# EAGLE design Pinscape Pico Expansion Board - DIY Friendly Power (EAGLE 7.7.0)

## Sheet 1 of 6: Picos
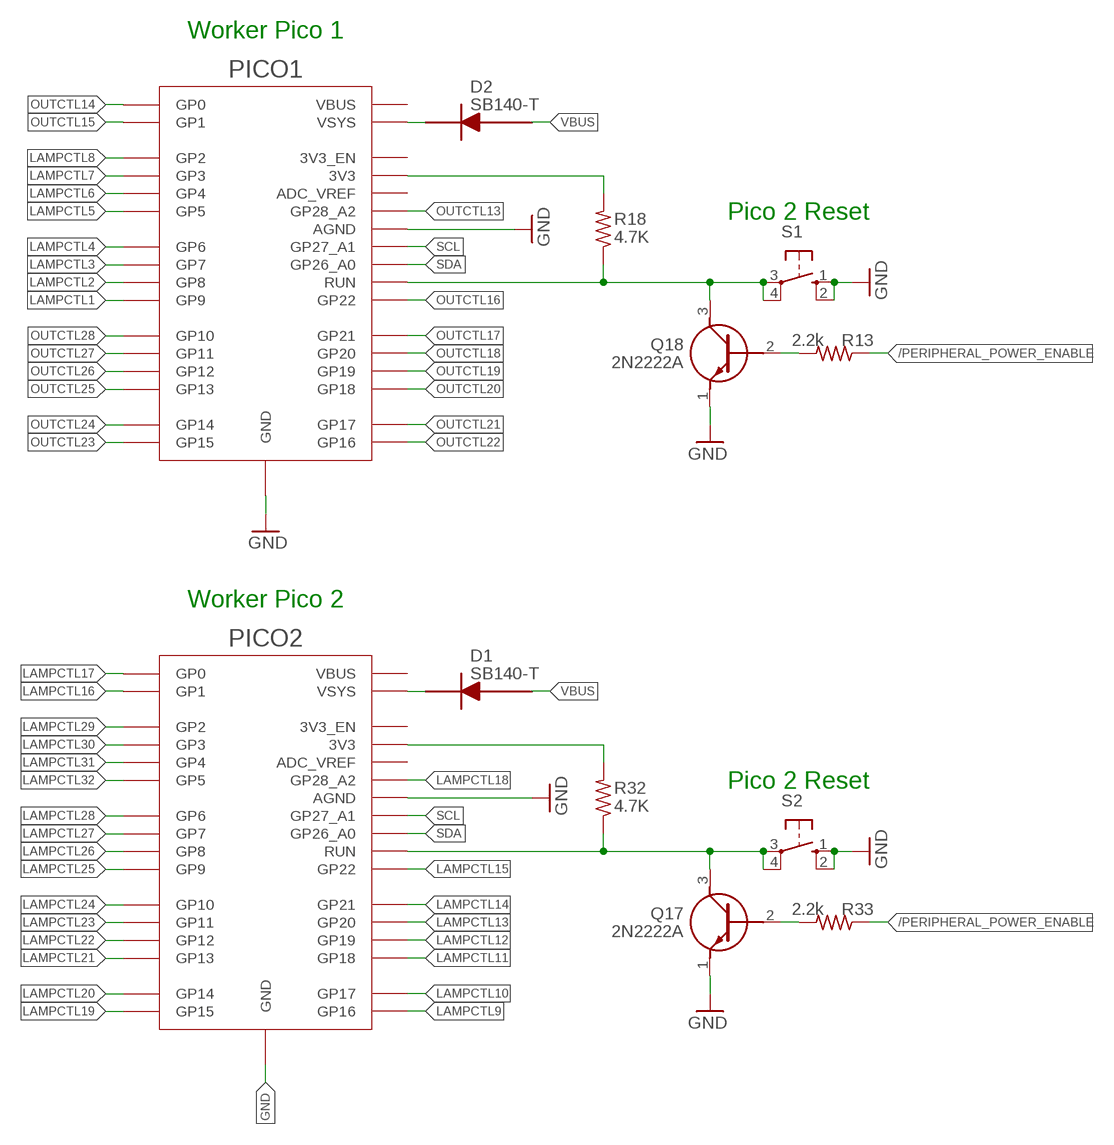
[diagram p0: schematic, sheet 1]

### Parts
D1  SB140-T  [DIOAD1408W86L464D236]
D2  SB140-T  [DIOAD1408W86L464D236]
PICO1  RPI_PICO_NO_DEBUG  [RPI_PICO_TH_NO_DEBUG]
PICO2  RPI_PICO_NO_DEBUG  [RPI_PICO_TH_NO_DEBUG]
Q17  2N2222A  [2N2222A]
Q18  2N2222A  [2N2222A]
R13  2.2k  R-US_0204/7  [0204/7]
R18  4.7K  R-US_0204/7  [0204/7]
R32  4.7K  R-US_0204/7  [0204/7]
R33  2.2k  R-US_0204/7  [0204/7]
S1  10-XX  [B3F-10XX]
S2  10-XX  [B3F-10XX]

### Nets
/PERIPHERAL_POWER_ENABLE: R13.1 R33.1 ; also sheet 2
GND: PICO1.AGND PICO1.GND@1(GND) PICO1.GND@2(GND) PICO1.GND@3(GND) PICO1.GND@4(GND) PICO1.GND@6(GND) PICO1.GND@7(GND) PICO1.GND@8(GND) PICO2.AGND PICO2.GND@1(GND) PICO2.GND@2(GND) PICO2.GND@3(GND) PICO2.GND@4(GND) PICO2.GND@6(GND) PICO2.GND@7(GND) PICO2.GND@8(GND) Q17.1(E) Q18.1(E) S1.1(S) S1.2(S1) S2.1(S) S2.2(S1) ; also sheet 2,3,4,5
LAMPCTL1: PICO1.GP9 ; also sheet 4
LAMPCTL2: PICO1.GP8 ; also sheet 4
LAMPCTL3: PICO1.GP7 ; also sheet 4
LAMPCTL4: PICO1.GP6 ; also sheet 4
LAMPCTL5: PICO1.GP5 ; also sheet 4
LAMPCTL6: PICO1.GP4 ; also sheet 4
LAMPCTL7: PICO1.GP3 ; also sheet 4
LAMPCTL8: PICO1.GP2 ; also sheet 4
LAMPCTL9: PICO2.GP16 ; also sheet 4
LAMPCTL10: PICO2.GP17 ; also sheet 4
LAMPCTL11: PICO2.GP18 ; also sheet 4
LAMPCTL12: PICO2.GP19 ; also sheet 4
LAMPCTL13: PICO2.GP20 ; also sheet 4
LAMPCTL14: PICO2.GP21 ; also sheet 4
LAMPCTL15: PICO2.GP22 ; also sheet 4
LAMPCTL16: PICO2.GP1 ; also sheet 4
LAMPCTL17: PICO2.GP0 ; also sheet 4
LAMPCTL18: PICO2.GP28_A2 ; also sheet 4
LAMPCTL19: PICO2.GP15 ; also sheet 4
LAMPCTL20: PICO2.GP14 ; also sheet 4
LAMPCTL21: PICO2.GP13 ; also sheet 4
LAMPCTL22: PICO2.GP12 ; also sheet 4
LAMPCTL23: PICO2.GP11 ; also sheet 4
LAMPCTL24: PICO2.GP10 ; also sheet 4
LAMPCTL25: PICO2.GP9 ; also sheet 4
LAMPCTL26: PICO2.GP8 ; also sheet 4
LAMPCTL27: PICO2.GP7 ; also sheet 4
LAMPCTL28: PICO2.GP6 ; also sheet 4
LAMPCTL29: PICO2.GP2 ; also sheet 4
LAMPCTL30: PICO2.GP3 ; also sheet 4
LAMPCTL31: PICO2.GP4 ; also sheet 4
LAMPCTL32: PICO2.GP5 ; also sheet 4
N$17: D1.1(K) PICO2.VSYS
N$18: D2.1(K) PICO1.VSYS
N$38: PICO2.3V3 R32.2
N$39: Q17.2(B) R33.2
N$40: PICO2.RUN Q17.3(C) R32.1 S2.3(P) S2.4(P1)
N$41: PICO1.3V3 R18.2
N$42: Q18.2(B) R13.2
N$51: PICO1.RUN Q18.3(C) R18.1 S1.3(P) S1.4(P1)
OUTCTL13: PICO1.GP28_A2 ; also sheet 3
OUTCTL14: PICO1.GP0 ; also sheet 3
OUTCTL15: PICO1.GP1 ; also sheet 3
OUTCTL16: PICO1.GP22 ; also sheet 3
OUTCTL17: PICO1.GP21 ; also sheet 3
OUTCTL18: PICO1.GP20 ; also sheet 3
OUTCTL19: PICO1.GP19 ; also sheet 3
OUTCTL20: PICO1.GP18 ; also sheet 3
OUTCTL21: PICO1.GP17 ; also sheet 3
OUTCTL22: PICO1.GP16 ; also sheet 3
OUTCTL23: PICO1.GP15 ; also sheet 3
OUTCTL24: PICO1.GP14 ; also sheet 3
OUTCTL25: PICO1.GP13 ; also sheet 3
OUTCTL26: PICO1.GP12 ; also sheet 3
OUTCTL27: PICO1.GP11 ; also sheet 3
OUTCTL28: PICO1.GP10 ; also sheet 3
SCL: PICO1.GP27_A1 PICO2.GP27_A1 ; also sheet 2,5
SDA: PICO1.GP26_A0 PICO2.GP26_A0 ; also sheet 2,5
VBUS: D1.2(A) D2.2(A) ; also sheet 2,5
Unconnected: PICO1.3V3_EN PICO1.ADC_VREF PICO1.VBUS PICO2.3V3_EN PICO2.ADC_VREF PICO2.VBUS

### Notes on the sheet
- Worker Pico 1
- Pico 2 Reset
- Worker Pico 2
- Pico 2 Reset

## Sheet 2 of 6: Misc Ports
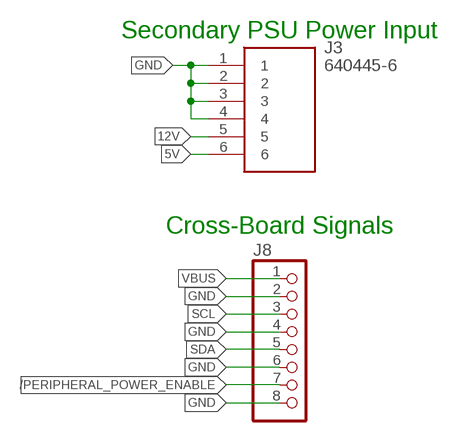
[diagram p1: schematic, sheet 2]

### Parts
J3  640445-6  [SHDR6W183P0X396_1X6_2377X762X1]
J8  PINHD-1X8/90  [1X08/90]

### Nets
5V: J3.6 ; also sheet 4
12V: J3.5 ; also sheet 3
/PERIPHERAL_POWER_ENABLE: J8.7 ; also sheet 1
GND: J3.1 J3.2 J3.3 J3.4 J8.2 J8.4 J8.6 J8.8 ; also sheet 1,3,4,5
SCL: J8.3 ; also sheet 1,5
SDA: J8.5 ; also sheet 1,5
VBUS: J8.1 ; also sheet 1,5

### Notes on the sheet
- Secondary PSU Power Input
- Cross-Board Signals

## Sheet 3 of 6: MOSFET Outputs
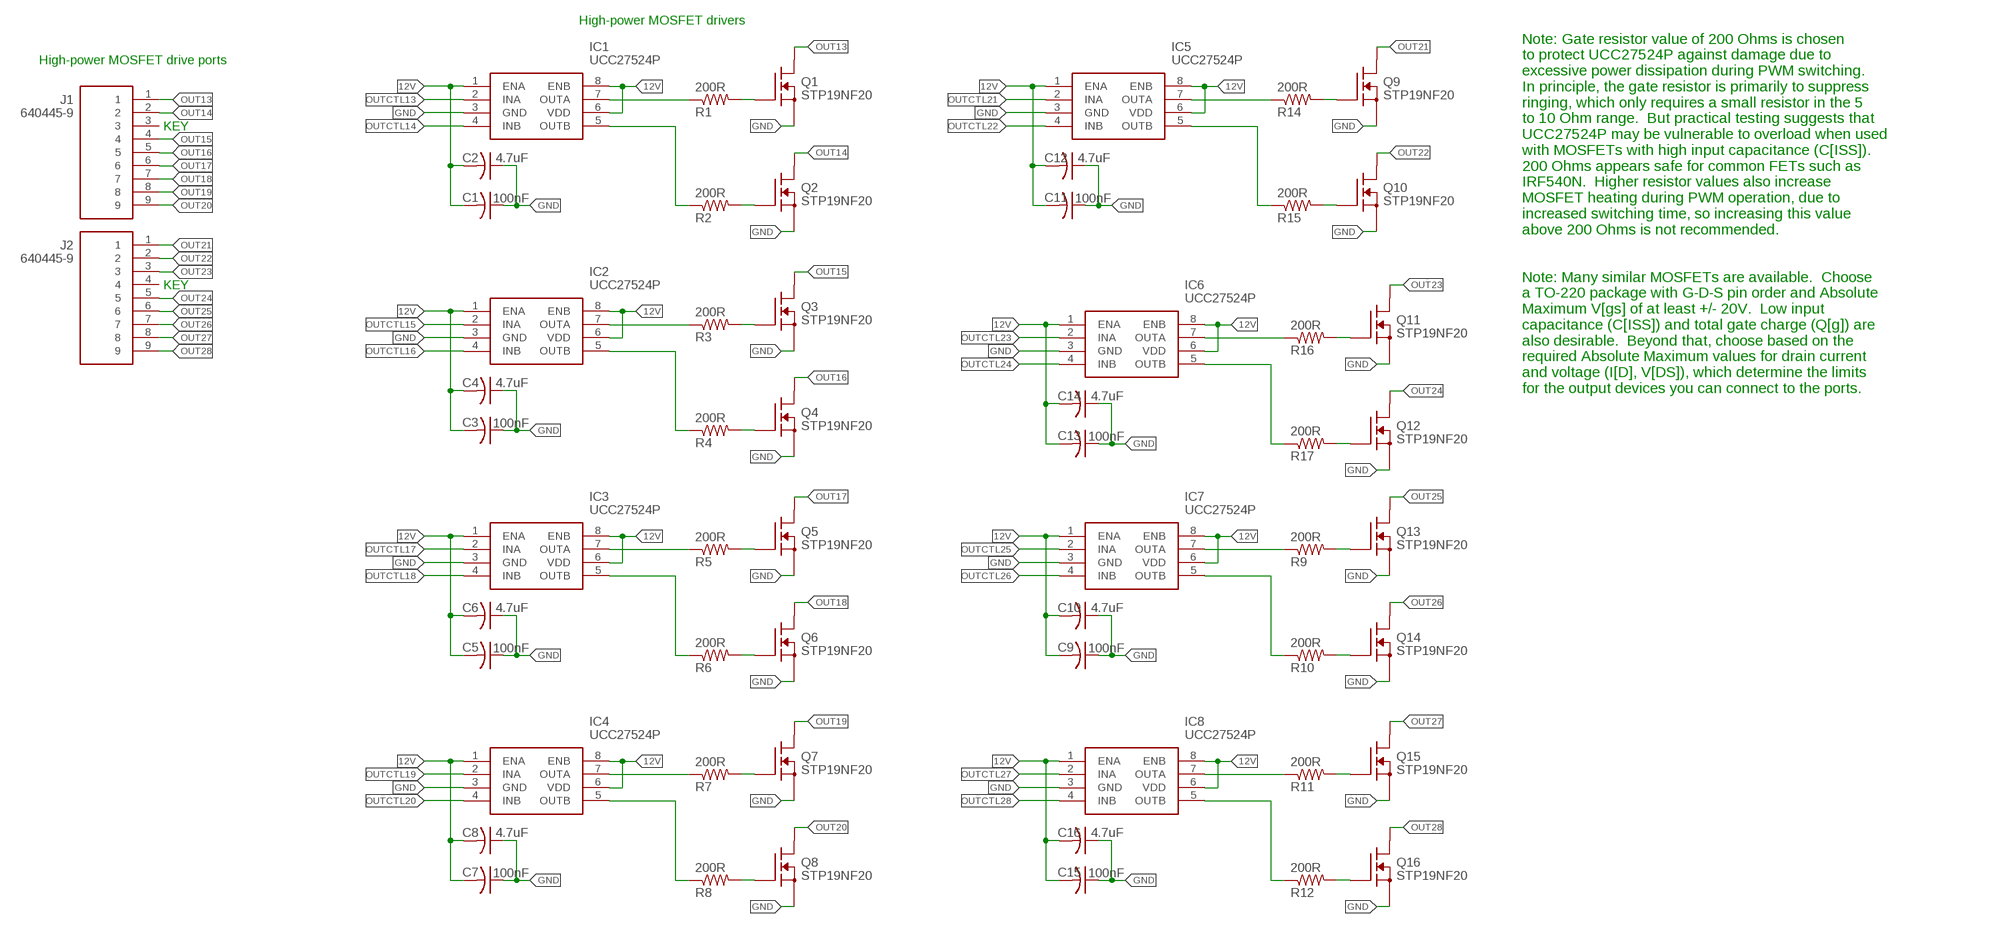
[diagram p2: schematic, sheet 3]

### Parts
C1  100nF  C-US025-024X044  [C025-024X044]
C2  4.7uF  C-US025-024X044  [C025-024X044]
C3  100nF  C-US025-024X044  [C025-024X044]
C4  4.7uF  C-US025-024X044  [C025-024X044]
C5  100nF  C-US025-024X044  [C025-024X044]
C6  4.7uF  C-US025-024X044  [C025-024X044]
C7  100nF  C-US025-024X044  [C025-024X044]
C8  4.7uF  C-US025-024X044  [C025-024X044]
C9  100nF  C-US025-024X044  [C025-024X044]
C10  4.7uF  C-US025-024X044  [C025-024X044]
C11  100nF  C-US025-024X044  [C025-024X044]
C12  4.7uF  C-US025-024X044  [C025-024X044]
C13  100nF  C-US025-024X044  [C025-024X044]
C14  4.7uF  C-US025-024X044  [C025-024X044]
C15  100nF  C-US025-024X044  [C025-024X044]
C16  4.7uF  C-US025-024X044  [C025-024X044]
IC1  UCC27524P  [DIP794W53P254L959H508Q8N]
IC2  UCC27524P  [DIP794W53P254L959H508Q8N]
IC3  UCC27524P  [DIP794W53P254L959H508Q8N]
IC4  UCC27524P  [DIP794W53P254L959H508Q8N]
IC5  UCC27524P  [DIP794W53P254L959H508Q8N]
IC6  UCC27524P  [DIP794W53P254L959H508Q8N]
IC7  UCC27524P  [DIP794W53P254L959H508Q8N]
IC8  UCC27524P  [DIP794W53P254L959H508Q8N]
J1  640445-9  [SHDR9W117P0X396_1X9_3566X762X1]
J2  640445-9  [SHDR9W117P0X396_1X9_3566X762X1]
Q1  STP19NF20  BUK7575-55A  [TO220BV]
Q2  STP19NF20  BUK7575-55A  [TO220BV]
Q3  STP19NF20  BUK7575-55A  [TO220BV]
Q4  STP19NF20  BUK7575-55A  [TO220BV]
Q5  STP19NF20  BUK7575-55A  [TO220BV]
Q6  STP19NF20  BUK7575-55A  [TO220BV]
Q7  STP19NF20  BUK7575-55A  [TO220BV]
Q8  STP19NF20  BUK7575-55A  [TO220BV]
Q9  STP19NF20  BUK7575-55A  [TO220BV]
Q10  STP19NF20  BUK7575-55A  [TO220BV]
Q11  STP19NF20  BUK7575-55A  [TO220BV]
Q12  STP19NF20  BUK7575-55A  [TO220BV]
Q13  STP19NF20  BUK7575-55A  [TO220BV]
Q14  STP19NF20  BUK7575-55A  [TO220BV]
Q15  STP19NF20  BUK7575-55A  [TO220BV]
Q16  STP19NF20  BUK7575-55A  [TO220BV]
R1  200R  R-US_0204/5  [0204/5]
R2  200R  R-US_0204/5  [0204/5]
R3  200R  R-US_0204/5  [0204/5]
R4  200R  R-US_0204/5  [0204/5]
R5  200R  R-US_0204/5  [0204/5]
R6  200R  R-US_0204/5  [0204/5]
R7  200R  R-US_0204/5  [0204/5]
R8  200R  R-US_0204/5  [0204/5]
R9  200R  R-US_0204/5  [0204/5]
R10  200R  R-US_0204/5  [0204/5]
R11  200R  R-US_0204/5  [0204/5]
R12  200R  R-US_0204/5  [0204/5]
R14  200R  R-US_0204/5  [0204/5]
R15  200R  R-US_0204/5  [0204/5]
R16  200R  R-US_0204/5  [0204/5]
R17  200R  R-US_0204/5  [0204/5]

### Nets
12V: C1.2 C2.2 C3.2 C4.2 C5.2 C6.2 C7.2 C8.2 C9.2 C10.2 C11.2 C12.2 C13.2 C14.2 C15.2 C16.2 IC1.1(ENA) IC1.6(VDD) IC1.8(ENB) IC2.1(ENA) IC2.6(VDD) IC2.8(ENB) IC3.1(ENA) IC3.6(VDD) IC3.8(ENB) IC4.1(ENA) IC4.6(VDD) IC4.8(ENB) IC5.1(ENA) IC5.6(VDD) IC5.8(ENB) IC6.1(ENA) IC6.6(VDD) IC6.8(ENB) IC7.1(ENA) IC7.6(VDD) IC7.8(ENB) IC8.1(ENA) IC8.6(VDD) IC8.8(ENB) ; also sheet 2
GND: C1.1 C2.1 C3.1 C4.1 C5.1 C6.1 C7.1 C8.1 C9.1 C10.1 C11.1 C12.1 C13.1 C14.1 C15.1 C16.1 IC1.3(GND) IC2.3(GND) IC3.3(GND) IC4.3(GND) IC5.3(GND) IC6.3(GND) IC7.3(GND) IC8.3(GND) Q1.3(S) Q2.3(S) Q3.3(S) Q4.3(S) Q5.3(S) Q6.3(S) Q7.3(S) Q8.3(S) Q9.3(S) Q10.3(S) Q11.3(S) Q12.3(S) Q13.3(S) Q14.3(S) Q15.3(S) Q16.3(S) ; also sheet 1,2,4,5
N$1: IC1.7(OUTA) R1.1
N$2: IC1.5(OUTB) R2.1
N$3: Q1.1(G) R1.2
N$4: Q2.1(G) R2.2
N$5: IC2.7(OUTA) R3.1
N$6: IC2.5(OUTB) R4.1
N$7: Q3.1(G) R3.2
N$8: Q4.1(G) R4.2
N$9: IC3.7(OUTA) R5.1
N$10: IC3.5(OUTB) R6.1
N$11: Q5.1(G) R5.2
N$12: Q6.1(G) R6.2
N$13: IC4.7(OUTA) R7.1
N$14: IC4.5(OUTB) R8.1
N$15: Q7.1(G) R7.2
N$16: Q8.1(G) R8.2
N$19: IC5.7(OUTA) R14.1
N$20: IC5.5(OUTB) R15.1
N$21: IC7.7(OUTA) R9.1
N$22: IC7.5(OUTB) R10.1
N$23: Q13.1(G) R9.2
N$24: Q14.1(G) R10.2
N$25: Q9.1(G) R14.2
N$26: Q10.1(G) R15.2
N$27: IC6.7(OUTA) R16.1
N$28: IC6.5(OUTB) R17.1
N$29: Q11.1(G) R16.2
N$30: Q12.1(G) R17.2
N$31: IC8.7(OUTA) R11.1
N$32: IC8.5(OUTB) R12.1
N$33: Q15.1(G) R11.2
N$34: Q16.1(G) R12.2
OUT13: J1.1 Q1.2(D)
OUT14: J1.2 Q2.2(D)
OUT15: J1.4 Q3.2(D)
OUT16: J1.5 Q4.2(D)
OUT17: J1.6 Q5.2(D)
OUT18: J1.7 Q6.2(D)
OUT19: J1.8 Q7.2(D)
OUT20: J1.9 Q8.2(D)
OUT21: J2.1 Q9.2(D)
OUT22: J2.2 Q10.2(D)
OUT23: J2.3 Q11.2(D)
OUT24: J2.5 Q12.2(D)
OUT25: J2.6 Q13.2(D)
OUT26: J2.7 Q14.2(D)
OUT27: J2.8 Q15.2(D)
OUT28: J2.9 Q16.2(D)
OUTCTL13: IC1.2(INA) ; also sheet 1
OUTCTL14: IC1.4(INB) ; also sheet 1
OUTCTL15: IC2.2(INA) ; also sheet 1
OUTCTL16: IC2.4(INB) ; also sheet 1
OUTCTL17: IC3.2(INA) ; also sheet 1
OUTCTL18: IC3.4(INB) ; also sheet 1
OUTCTL19: IC4.2(INA) ; also sheet 1
OUTCTL20: IC4.4(INB) ; also sheet 1
OUTCTL21: IC5.2(INA) ; also sheet 1
OUTCTL22: IC5.4(INB) ; also sheet 1
OUTCTL23: IC6.2(INA) ; also sheet 1
OUTCTL24: IC6.4(INB) ; also sheet 1
OUTCTL25: IC7.2(INA) ; also sheet 1
OUTCTL26: IC7.4(INB) ; also sheet 1
OUTCTL27: IC8.2(INA) ; also sheet 1
OUTCTL28: IC8.4(INB) ; also sheet 1
Unconnected: J1.3 J2.4

### Notes on the sheet
- High-power MOSFET drivers
- Note: Gate resistor value of 200 Ohms is chosen
  to protect UCC27524P against damage due to
  excessive power dissipation during PWM switching.
  In principle, the gate resistor is primarily to suppress
  ringing, which only requires a small resistor in the 5
  to 10 Ohm range.  But practical testing suggests that
  UCC27524P may be vulnerable to overload when used
  with MOSFETs with high input capacitance (C[ISS]).
  200 Ohms appears safe for common FETs such as
  IRF540N.  Higher resistor values also increase
  MOSFET heating during PWM operation, due to
  increased switching time, so increasing this value
  above 200 Ohms is not recommended.
- High-power MOSFET drive ports
- KEY
- Note: Many similar MOSFETs are available.  Choose
  a TO-220 package with G-D-S pin order and Absolute
  Maximum V[gs] of at least +/- 20V.  Low input
  capacitance (C[ISS]) and total gate charge (Q[g]) are
  also desirable.  Beyond that, choose based on the
  required Absolute Maximum values for drain current
  and voltage (I[D], V[DS]), which determine the limits
  for the output devices you can connect to the ports.
- KEY

## Sheet 4 of 6: Lamp Outputs
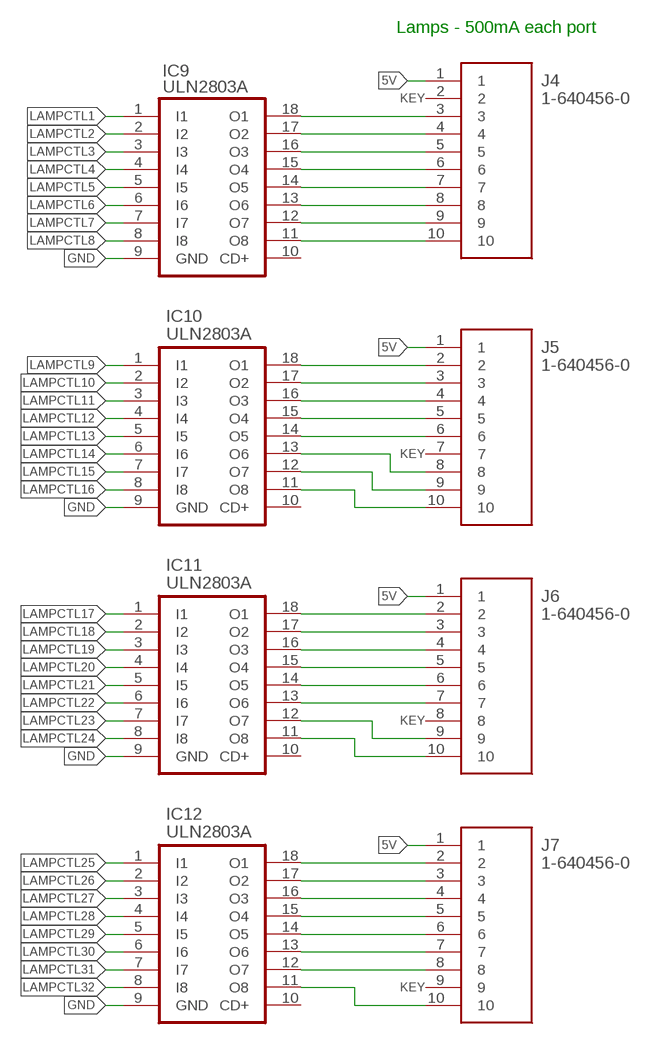
[diagram p3: schematic, sheet 4]

### Parts
IC9  ULN2803A  [DIL18]
IC10  ULN2803A  [DIL18]
IC11  ULN2803A  [DIL18]
IC12  ULN2803A  [DIL18]
J4  1-640456-0  [SHDR10W66P0X254_1X10_2540X572X]
J5  1-640456-0  [SHDR10W66P0X254_1X10_2540X572X]
J6  1-640456-0  [SHDR10W66P0X254_1X10_2540X572X]
J7  1-640456-0  [SHDR10W66P0X254_1X10_2540X572X]

### Nets
5V: J4.1 J5.1 J6.1 J7.1 ; also sheet 2
GND: IC9.9(GND) IC10.9(GND) IC11.9(GND) IC12.9(GND) ; also sheet 1,2,3,5
LAMPCTL1: IC9.1(I1) ; also sheet 1
LAMPCTL2: IC9.2(I2) ; also sheet 1
LAMPCTL3: IC9.3(I3) ; also sheet 1
LAMPCTL4: IC9.4(I4) ; also sheet 1
LAMPCTL5: IC9.5(I5) ; also sheet 1
LAMPCTL6: IC9.6(I6) ; also sheet 1
LAMPCTL7: IC9.7(I7) ; also sheet 1
LAMPCTL8: IC9.8(I8) ; also sheet 1
LAMPCTL9: IC10.1(I1) ; also sheet 1
LAMPCTL10: IC10.2(I2) ; also sheet 1
LAMPCTL11: IC10.3(I3) ; also sheet 1
LAMPCTL12: IC10.4(I4) ; also sheet 1
LAMPCTL13: IC10.5(I5) ; also sheet 1
LAMPCTL14: IC10.6(I6) ; also sheet 1
LAMPCTL15: IC10.7(I7) ; also sheet 1
LAMPCTL16: IC10.8(I8) ; also sheet 1
LAMPCTL17: IC11.1(I1) ; also sheet 1
LAMPCTL18: IC11.2(I2) ; also sheet 1
LAMPCTL19: IC11.3(I3) ; also sheet 1
LAMPCTL20: IC11.4(I4) ; also sheet 1
LAMPCTL21: IC11.5(I5) ; also sheet 1
LAMPCTL22: IC11.6(I6) ; also sheet 1
LAMPCTL23: IC11.7(I7) ; also sheet 1
LAMPCTL24: IC11.8(I8) ; also sheet 1
LAMPCTL25: IC12.1(I1) ; also sheet 1
LAMPCTL26: IC12.2(I2) ; also sheet 1
LAMPCTL27: IC12.3(I3) ; also sheet 1
LAMPCTL28: IC12.4(I4) ; also sheet 1
LAMPCTL29: IC12.5(I5) ; also sheet 1
LAMPCTL30: IC12.6(I6) ; also sheet 1
LAMPCTL31: IC12.7(I7) ; also sheet 1
LAMPCTL32: IC12.8(I8) ; also sheet 1
N$43: IC12.18(O1) J7.2
N$44: IC12.17(O2) J7.3
N$45: IC12.16(O3) J7.4
N$46: IC12.15(O4) J7.5
N$47: IC12.14(O5) J7.6
N$48: IC12.13(O6) J7.7
N$49: IC12.12(O7) J7.8
N$50: IC12.11(O8) J7.10
N$59: IC11.18(O1) J6.2
N$60: IC11.17(O2) J6.3
N$61: IC11.16(O3) J6.4
N$62: IC11.15(O4) J6.5
N$63: IC11.14(O5) J6.6
N$64: IC11.13(O6) J6.7
N$65: IC11.12(O7) J6.9
N$66: IC11.11(O8) J6.10
N$67: IC9.18(O1) J4.3
N$68: IC9.17(O2) J4.4
N$69: IC9.16(O3) J4.5
N$70: IC9.15(O4) J4.6
N$71: IC9.14(O5) J4.7
N$72: IC9.13(O6) J4.8
N$73: IC9.12(O7) J4.9
N$74: IC9.11(O8) J4.10
N$75: IC10.18(O1) J5.2
N$76: IC10.17(O2) J5.3
N$77: IC10.16(O3) J5.4
N$78: IC10.15(O4) J5.5
N$79: IC10.14(O5) J5.6
N$80: IC10.13(O6) J5.8
N$81: IC10.12(O7) J5.9
N$82: IC10.11(O8) J5.10
Unconnected: IC9.10(CD+) IC10.10(CD+) IC11.10(CD+) IC12.10(CD+) J4.2 J5.7 J6.8 J7.9

### Notes on the sheet
- Lamps - 500mA each port
- KEY
- KEY
- KEY
- KEY

## Sheet 5 of 6: Real-Time Clock
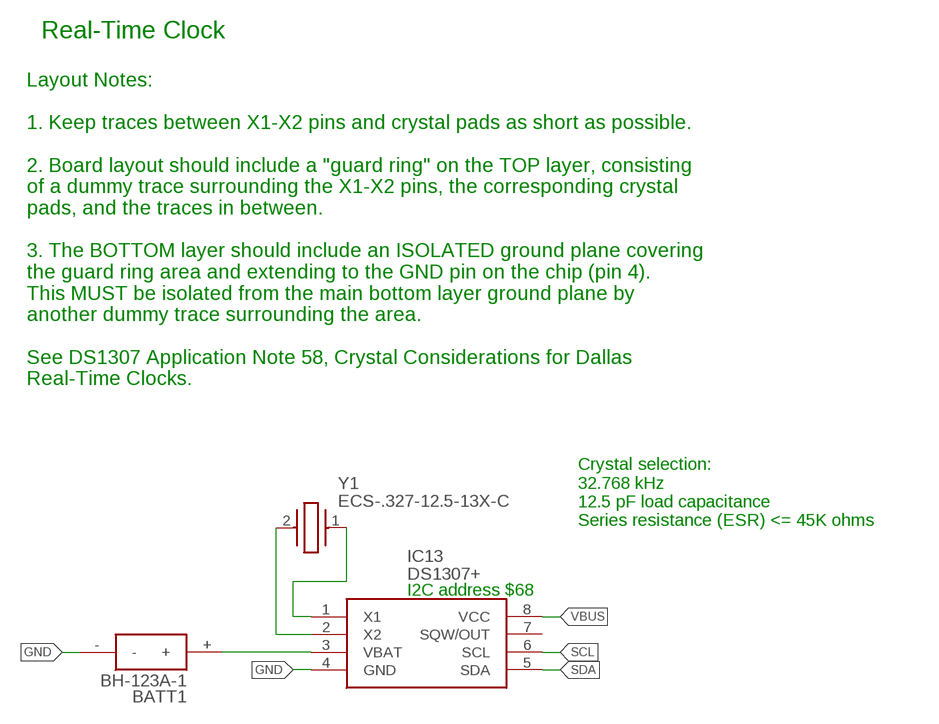
[diagram p4: schematic, sheet 5]

### Parts
BATT1  BH-123A-1  [BH-123A-1]
IC13  DS1307+  [DIP794W56P254L938H457Q8N]
Y1  ECS-.327-12.5-13X-C  [ECS32712513XC]

### Nets
GND: BATT1.- IC13.4(GND) ; also sheet 1,2,3,4
N$35: BATT1.+ IC13.3(VBAT)
N$36: IC13.1(X1) Y1.1(CRYSTAL_1)
N$37: IC13.2(X2) Y1.2(CRYSTAL_2)
SCL: IC13.6(SCL) ; also sheet 1,2
SDA: IC13.5(SDA) ; also sheet 1,2
VBUS: IC13.8(VCC) ; also sheet 1,2
Unconnected: IC13.7(SQW/OUT)

### Notes on the sheet
- Real-Time Clock
- Layout Notes:
  
  1. Keep traces between X1-X2 pins and crystal pads as short as possible.
  
  2. Board layout should include a "guard ring" on the TOP layer, consisting
  of a dummy trace surrounding the X1-X2 pins, the corresponding crystal
  pads, and the traces in between.
  
  3. The BOTTOM layer should include an ISOLATED ground plane covering
  the guard ring area and extending to the GND pin on the chip (pin 4).
  This MUST be isolated from the main bottom layer ground plane by
  another dummy trace surrounding the area.
  
  See DS1307 Application Note 58, Crystal Considerations for Dallas
  Real-Time Clocks.
- Crystal selection:
  32.768 kHz
  12.5 pF load capacitance
  Series resistance (ESR) <= 45K ohms
- I2C address $68

## Sheet 6 of 6: Notes
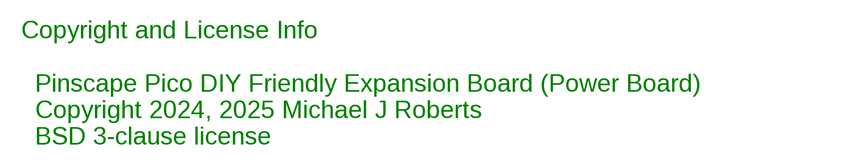
[diagram p5: schematic, sheet 6]

### Notes on the sheet
- Copyright and License Info
  
    Pinscape Pico DIY Friendly Expansion Board (Power Board)
    Copyright 2024, 2025 Michael J Roberts
    BSD 3-clause license

## Library data of the parts
BATT1 = SamacSys_Parts:BH-123A-1: Coin Cell Battery Holders Bat Hld CR2032/2025 Through-hole Mount Source: Datasheet <https://componentsearchengine.com/Datasheets/1/BAT-HLD-001-THM.pdf>
C1 C3 C5 C7 C9 C11 C13 C15 = rcl:C-US: CAPACITOR, American symbol; PARTNO: 21RZ310-RC
C2 C4 C6 C8 C10 C12 C14 C16 = rcl:C-US: CAPACITOR, American symbol; PARTNO: 810-FG14X5R1H475KRT0
D1 D2 = SamacSys_Parts:SB140-T: Schottky Diodes & Rectifiers 1.0A 40V Source: Datasheet <https://www.arrow.com/en/products/sb140-t/diodes-incorporated>; DESCRIPTION: Schottky Diodes & Rectifiers 1.0A 40V; HEIGHT: mm; MANUFACTURER_NAME: Diodes Incorporated; MANUFACTURER_PART_NUMBER: SB140-T; MOUSER_PART_NUMBER: 621-SB140-T; MOUSER_PRICE-STOCK: https://www.mouser.co.uk/ProductDetail/Diodes-Incorporated/SB140-T?qs=sxN%252BoM2fis8H2rSIUCd%252Bfg%3D%3D
IC1-IC8 = SamacSys_Parts:UCC27524P: Dual, 5A, High-Speed Low-Side Power MOSFET Driver Source: Datasheet <http://www.ti.com/lit/gpn/ucc27524>; DESCRIPTION: Dual, 5A, High-Speed Low-Side Power MOSFET Driver; HEIGHT: 5.08mm; MANUFACTURER_NAME: Texas Instruments; MANUFACTURER_PART_NUMBER: UCC27524P; MOUSER_PART_NUMBER: 595-UCC27524P; MOUSER_PRICE-STOCK: https://www.mouser.co.uk/ProductDetail/Texas-Instruments/UCC27524P?qs=iuXUNOC6nYeLYu3RiGlNsQ%3D%3D
IC9-IC12 = uln-udn:ULN2803A: DRIVER ARRAY
IC13 = SamacSys_Parts:DS1307+: Real time clock,DS1307 56B RAM DIP8 Maxim DS1307+ Real Time Clock, Alarm, Calendar, Clock, 56B RAM, I2C, 5.5 V, 8-Pin PDIP Source: Datasheet <http://datasheets.maximintegrated.com/en/ds/DS1307.pdf>; DESCRIPTION: Real time clock,DS1307 56B RAM DIP8 Maxim DS1307+ Real Time Clock, Alarm, Calendar, Clock, 56B RAM, I2C, 5.5 V, 8-Pin PDIP; HEIGHT: 4.572mm; MANUFACTURER_NAME: Analog Devices; MANUFACTURER_PART_NUMBER: DS1307+; MOUSER_PART_NUMBER: 700-DS1307; MOUSER_PRICE-STOCK: https://www.mouser.co.uk/ProductDetail/Analog-Devices-Maxim-Integrated/DS1307%2b?qs=0Y9aZN%252BMVCVfCMpmynAtEg%3D%3D
J1 J2 = SamacSys_Parts:640445-9: Header,MTA156,straight,3.96mm,9way Source: Datasheet <https://www.te.com/commerce/DocumentDelivery/DDEController?Action=srchrtrv&DocNm=82056_MTA&DocType=Data Sheet&DocLang=English&PartCntxt=640445-9&DocFormat=pdf>; DESCRIPTION: Header,MTA156,straight,3.96mm,9way; HEIGHT: 13.716mm; MANUFACTURER_NAME: TE Connectivity; MANUFACTURER_PART_NUMBER: 640445-9; MOUSER_PART_NUMBER: 571-6404459; MOUSER_PRICE-STOCK: https://www.mouser.co.uk/ProductDetail/TE-Connectivity/640445-9?qs=P8zzrVhehauUywCYO3wBKg%3D%3D
J3 = SamacSys_Parts:640445-6: 6 way friction lock header,3.96mm pitch Source: Datasheet <https://componentsearchengine.com/Datasheets/1/640445-6.pdf>; DESCRIPTION: 6 way friction lock header,3.96mm pitch; HEIGHT: 11.049mm; MANUFACTURER_NAME: TE Connectivity; MANUFACTURER_PART_NUMBER: 640445-6; MOUSER_PART_NUMBER: 571-6404456; MOUSER_PRICE-STOCK: https://www.mouser.com/Search/Refine.aspx?Keyword=571-6404456
J4-J7 = SamacSys_Parts:1-640456-0: 10 way MTA straight friction lock header Source: Datasheet <https://datasheet.datasheetarchive.com/originals/distributors/Datasheets_SAMA/53b6d75d7446c4158b7609f45acef8cd.pdf>; DESCRIPTION: 10 way MTA straight friction lock header; HEIGHT: 10.414mm; MANUFACTURER_NAME: TE Connectivity; MANUFACTURER_PART_NUMBER: 1-640456-0; MOUSER_PART_NUMBER: 571-16404560; MOUSER_PRICE-STOCK: https://www.mouser.co.uk/ProductDetail/TE-Connectivity-AMP/1-640456-0?qs=%2F35zJ5USjomFMMbv03PGrg%3D%3D
J8 = pinhead:PINHD-1X8: PIN HEADER
PICO1 PICO2 = RaspberryPi_Pico:RPI_PICO_NO_DEBUG
Q1-Q16 = BUK7575:BUK7575-55A; PARTNO: FDPF085N10A
Q17 Q18 = SamacSys_Parts:2N2222A: NPN General purpose transistor . IC 150 mA . f 100 MHz Source: Datasheet <https://diotec.com/request/datasheet/2n2222a.pdf>; DESCRIPTION: NPN General purpose transistor . IC 150 mA . f 100 MHz; HEIGHT: 7.5mm; MANUFACTURER_NAME: Diotec; MANUFACTURER_PART_NUMBER: 2N2222A; MOUSER_PART_NUMBER: 637-2N2222A; MOUSER_PRICE-STOCK: https://www.mouser.co.uk/ProductDetail/Diotec-Semiconductor/2N2222A?qs=OlC7AqGiEDmNlRSTGL2dYg%3D%3D
R1-R18 R32 R33 = resistor:R-US_: RESISTOR, American symbol; PARTNO: 660-MFS1/4DCT52R47R0
S1 S2 = switch-omron:10-XX: OMRON SWITCH; MPN: B3F-1000; OC_FARNELL: 176432; OC_NEWARK: 36M3542
Y1 = SamacSys_Parts:ECS-.327-12.5-13X-C: Crystals CRYSTAL 32.768 kHZ 12.5 PF SMD, ESR 35K Ohms, +/-10ppm -20 C 70 C, 2.1 x 6.2 1 uw Max +/- 3 ppm 1st Year Aging Max Source: Datasheet; DESCRIPTION: Crystals CRYSTAL 32.768 kHZ 12.5 PF SMD, ESR 35K Ohms, +/-10ppm -20 C 70 C, 2.1 x 6.2 1 uw Max +/- 3 ppm 1st Year Aging Max; HEIGHT: 6.2mm; MANUFACTURER_NAME: ECS; MANUFACTURER_PART_NUMBER: ECS-.327-12.5-13X-C; MOUSER_PART_NUMBER: 520-S-.32712.513XC; MOUSER_PRICE-STOCK: https://www.mouser.co.uk/ProductDetail/ECS/ECS-.327-12.5-13X-C?qs=zW32dvEIR3sSXlfaut3cdQ%3D%3D

## Board
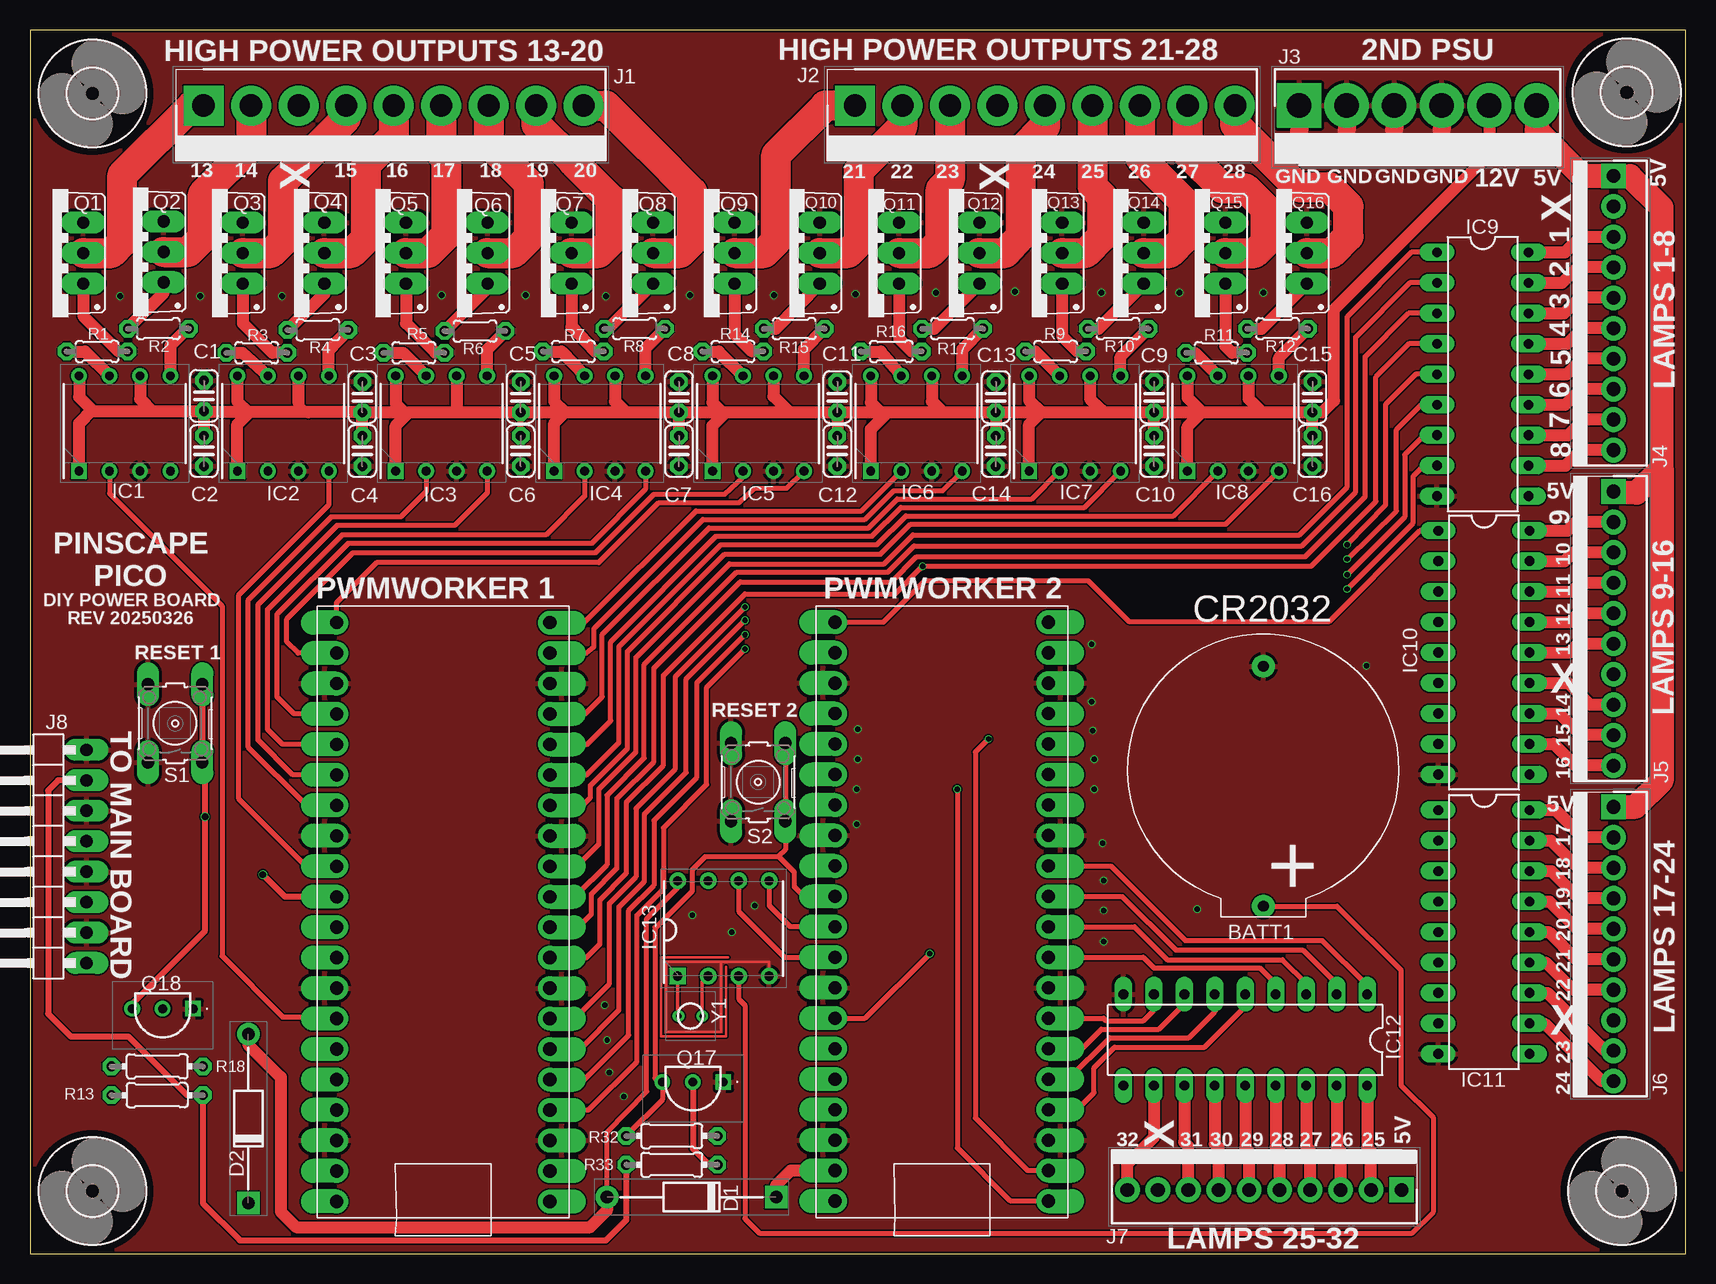
[diagram p6: board, top side]
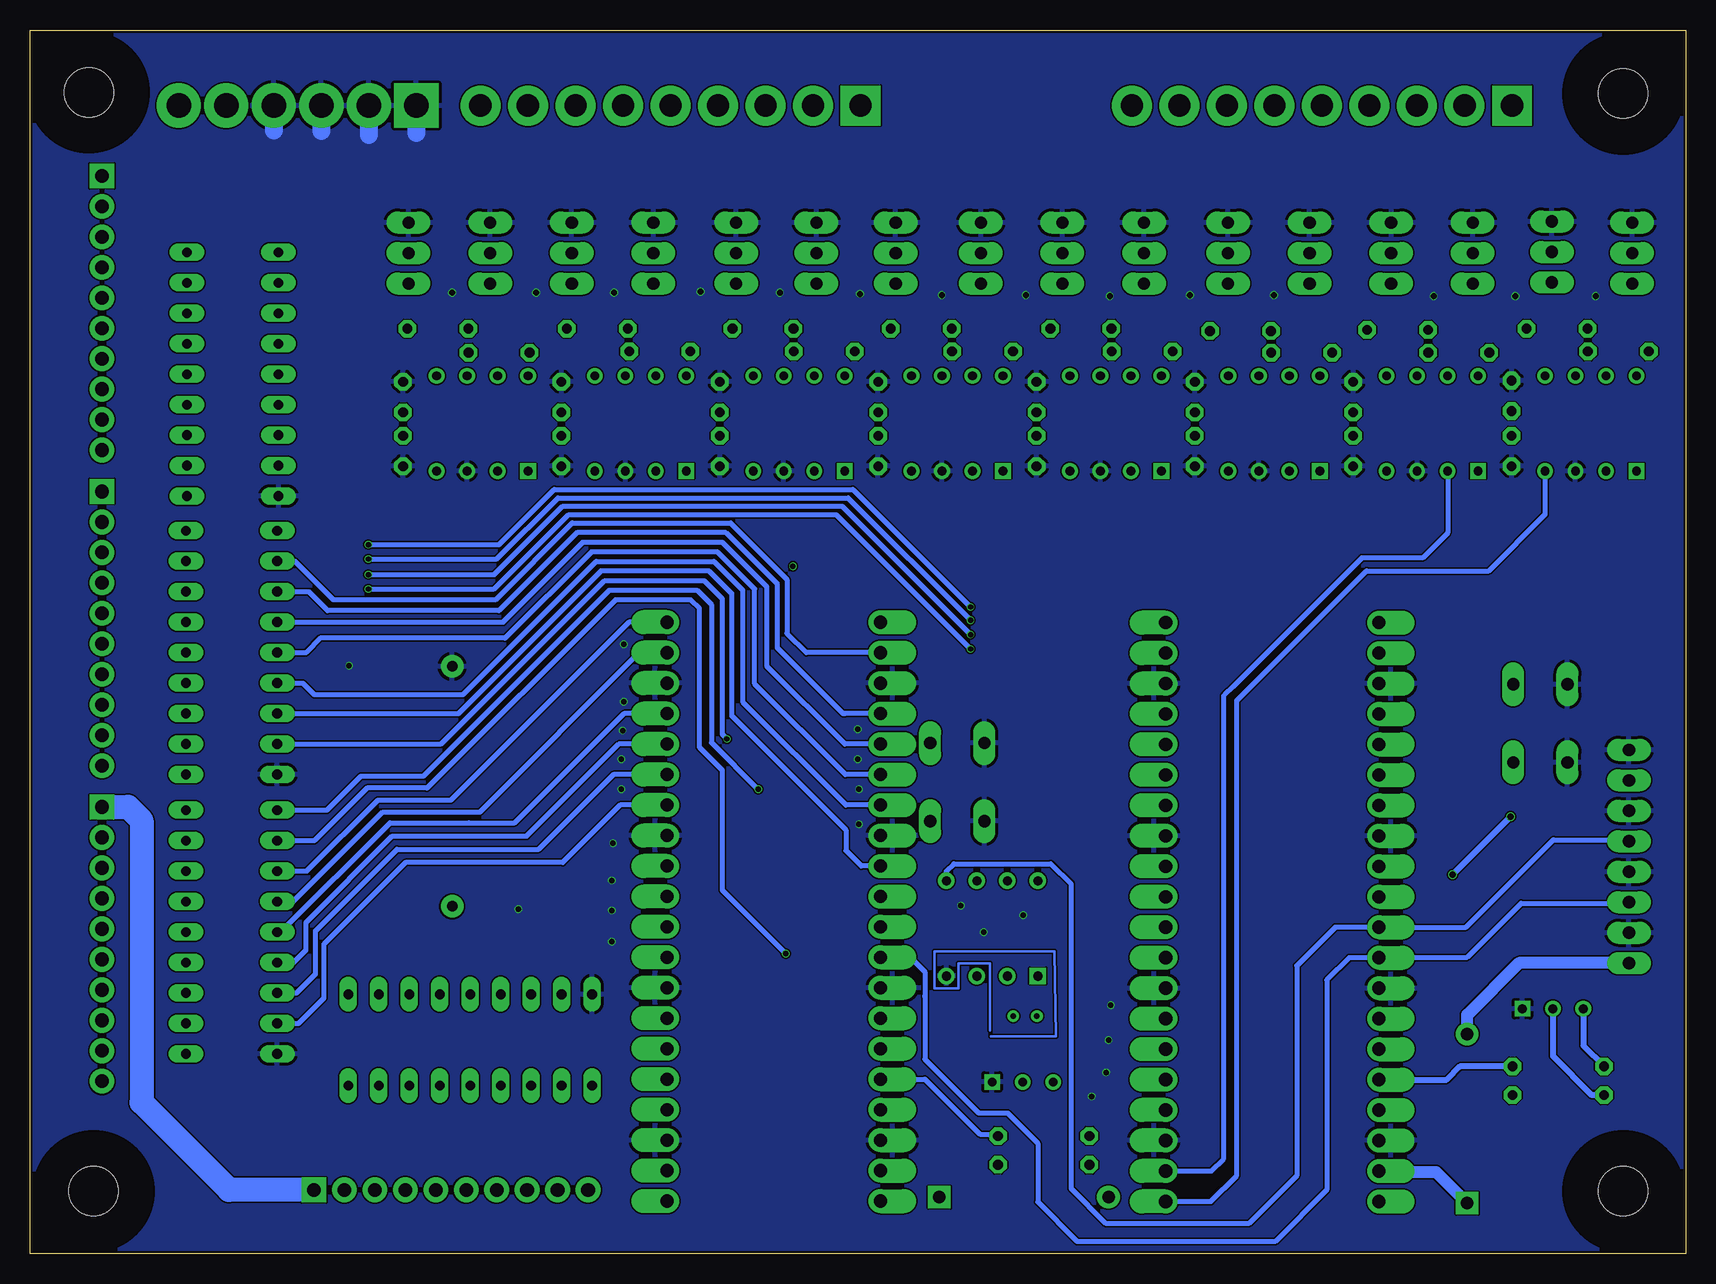
[diagram p7: board, bottom side, seen from below]

Size 138 x 102 mm. Coordinates in mm from the lower left corner, seen from the top.
Outline: 0,0 138,0 138,102 0,102 0,0
Copper layers (1*16): Top 0.035mm / dielectric 1.6mm / Bottom 0.035mm
Design rules "jlcpcb-2layers": minimum track width 5mil, minimum drill 0.3mm, track to track 5mil, track to pad 5mil, pad to pad 5mil, via to via 5mil, smd to smd 5mil, copper to edge 0.2mm, drill to drill 6mil, minimum pad ring 10mil, minimum via ring 3mil, stop-mask expansion 4mil, vias tented up to drill 0mil, thermal gap 10mil

### Footprints (pad centres in the part's own frame; a part is rotated, then mirrored left to right if it is on the bottom)
BH-123A-1 = drill 0.9 pad 1.9: + 11.45,0; - -8.55,0
C025-024X044 = drill 0.813 octagon: 1 -1.27,0; 2 1.27,0
DIOAD1408W86L464D236 = drill 1.05 pad 1.575 square: 1 0,0 | drill 1.05 pad 1.575: 2 14.1,0
DIP794W53P254L959H508Q8N = drill 0.73 pad 1.13 square: 1 -3.97,3.81 | drill 0.73 pad 1.13: 2 -3.97,1.27; 3 -3.97,-1.27; 4 -3.97,-3.81; 5 3.97,-3.81; 6 3.97,-1.27; 7 3.97,1.27; 8 3.97,3.81
DIL18 = drill 0.813 long: 1 -10.16,-3.81; 2 -7.62,-3.81; 3 -5.08,-3.81; 4 -2.54,-3.81; 5 0,-3.81; 6 2.54,-3.81; 7 5.08,-3.81; 8 7.62,-3.81; 9 10.16,-3.81; 10 10.16,3.81; 11 7.62,3.81; 12 5.08,3.81; 13 2.54,3.81; 14 0,3.81; 15 -2.54,3.81; 16 -5.08,3.81; 17 -7.62,3.81; 18 -10.16,3.81
DIP794W56P254L938H457Q8N = drill 0.76 pad 1.16 square: 1 -3.97,3.81 | drill 0.76 pad 1.16: 2 -3.97,1.27; 3 -3.97,-1.27; 4 -3.97,-3.81; 5 3.97,-3.81; 6 3.97,-1.27; 7 3.97,1.27; 8 3.97,3.81
SHDR9W117P0X396_1X9_3566X762X1 = drill 1.85 pad 2.775 square: 1 15.84,0 | drill 1.85 pad 2.775: 2 11.878,0; 3 7.916,0; 4 3.954,0; 5 -0.008,0; 6 -3.97,0; 7 -7.932,0; 8 -11.894,0; 9 -15.856,0
SHDR6W183P0X396_1X6_2377X762X1 = drill 2.05 pad 3.075 square: 1 0,0 | drill 2.05 pad 3.075: 2 3.96,0; 3 7.92,0; 4 11.88,0; 5 15.84,0; 6 19.8,0
SHDR10W66P0X254_1X10_2540X572X = drill 1.15 pad 1.725 square: 1 11.43,0 | drill 1.15 pad 1.725: 2 8.89,0; 3 6.35,0; 4 3.81,0; 5 1.27,0; 6 -1.27,0; 7 -3.81,0; 8 -6.35,0; 9 -8.89,0; 10 -11.43,0
1X08/90 = drill 1.016 long: 1 -8.89,-3.81; 2 -6.35,-3.81; 3 -3.81,-3.81; 4 -1.27,-3.81; 5 1.27,-3.81; 6 3.81,-3.81; 7 6.35,-3.81; 8 8.89,-3.81
RPI_PICO_TH_NO_DEBUG = drill 1.1 pad 1.6 offset: 3V3 8.89,13.97; 3V3_EN 8.89,16.51; ADC_VREF 8.89,11.43; AGND 8.89,6.35; GND@1 -8.89,19.05; GND@2 -8.89,6.35; GND@3 -8.89,-6.35; GND@4 -8.89,-19.05; GND@6 8.89,-19.05; GND@7 8.89,-6.35; GND@8 8.89,19.05; GP0 -8.89,24.13; GP1 -8.89,21.59; GP2 -8.89,16.51; GP3 -8.89,13.97; GP4 -8.89,11.43; GP5 -8.89,8.89; GP6 -8.89,3.81; GP7 -8.89,1.27; GP8 -8.89,-1.27; GP9 -8.89,-3.81; GP10 -8.89,-8.89; GP11 -8.89,-11.43; GP12 -8.89,-13.97; GP13 -8.89,-16.51; GP14 -8.89,-21.59; GP15 -8.89,-24.13; GP16 8.89,-24.13; GP17 8.89,-21.59; GP18 8.89,-16.51; GP19 8.89,-13.97; GP20 8.89,-11.43; GP21 8.89,-8.89; GP22 8.89,-3.81; GP26_A0 8.89,1.27; GP27_A1 8.89,3.81; GP28_A2 8.89,8.89; RUN 8.89,-1.27; VBUS 8.89,24.13; VSYS 8.89,21.59
TO220BV = drill 1.016 long: 1 -2.54,-2.54; 2 0,-2.54; 3 2.54,-2.54
2N2222A = drill 0.72 pad 1.234 square: 1 0,0 | drill 0.72 pad 1.234: 2 2.54,0; 3 5.08,0
0204/5 = drill 0.813 pad 1.333 octagon: 1 -2.54,0; 2 2.54,0
0204/7 = drill 0.813 octagon: 1 -3.81,0; 2 3.81,0
B3F-10XX = drill 1.016 long: 1 -3.251,2.261; 2 3.251,2.261; 3 -3.251,-2.261; 4 3.251,-2.261
4,1 = hole 4.1: 0,0
ECS32712513XC = drill 0.46 pad 0.6: 1 -0.635,0; 2 1.335,0

### Placement (x,y rotation side)
BATT1  102.8,40.4 270 top
C1  14.5,71.5 270 top
C2  14.5,66.9 90 top
C3  27.7,71.4 270 top
C4  27.7,66.9 90 top
C5  40.9,71.4 270 top
C6  40.9,66.9 90 top
C7  54.1,66.9 90 top
C8  54.1,71.4 270 top
C9  93.7,71.4 270 top
C10  93.7,66.9 90 top
C11  67.3,71.4 270 top
C12  67.3,66.9 90 top
C13  80.5,71.4 270 top
C14  80.5,66.9 90 top
C15  106.9,71.4 270 top
C16  106.9,66.9 90 top
D1  62.2,4.7 180 top
D2  18.2,4.2 90 top
IC1  7.9,69.2 90 top
IC2  21.1,69.2 90 top
IC3  34.3,69.2 90 top
IC4  47.5,69.2 90 top
IC5  60.7,69.2 90 top
IC6  73.9,69.2 90 top
IC7  87.1,69.2 90 top
IC8  100.3,69.2 90 top
IC9  121.1,73.3 270 top
IC10  121.2,50.1 270 top
IC11  121.2,26.8 270 top
IC12  101.3,17.8 180 top
IC13  57.8,27.1 90 top
J1  30.3,95.7 180 top
J2  84.6,95.7 180 top
J3  105.8,95.7 0 top
J4  132,78.4 90 top
J5  132,52.1 90 top
J6  132,25.8 90 top
J7  102.9,5.3 0 top
J8  0.9,33.1 90 top
PICO1  34.45,28.47 180 top
PICO2  76,28.5 180 top
Q1  1.9,83.4 90 top
Q2  8.6,83.5 90 top
Q3  15.2,83.4 90 top
Q4  22,83.4 90 top
Q5  28.8,83.4 90 top
Q6  35.6,83.4 90 top
Q7  42.6,83.4 90 top
Q8  49.4,83.4 90 top
Q9  56.2,83.4 90 top
Q10  63.3,83.4 90 top
Q11  69.9,83.4 90 top
Q12  76.6,83.4 90 top
Q13  83.5,83.4 90 top
Q14  90.3,83.4 90 top
Q15  97.1,83.4 90 top
Q16  103.9,83.4 90 top
Q17  57.8,14.3 180 top
Q18  13.6,20.4 180 top
R1  5.6,75.2 0 top
R2  10.7,77.1 180 top
R3  18.9,75.1 0 top
R4  24,77 180 top
R5  32,75.1 0 top
R6  37.1,76.9 180 top
R7  45.3,75.2 0 top
R8  50.4,77.1 180 top
R9  85.5,75.2 0 top
R10  90.7,77.1 180 top
R11  98.9,75.1 0 top
R12  104,77.1 180 top
R13  10.6,13.2 180 top
R14  58.6,75.2 0 top
R15  63.7,77.1 180 top
R16  71.8,75.2 0 top
R17  76.9,77.1 180 top
R18  10.6,15.6 0 top
R32  53.5,9.8 0 top
R33  53.5,7.4 0 top
S1  12.1,44.2 90 top
S2  60.7,39.3 90 top
U$1  [4,1]  5.2,96.7 0 top
U$2  [4,1]  133.1,96.8 0 top
U$3  [4,1]  132.7,5.2 0 top
U$4  [4,1]  5.2,5.2 0 top
Y1  54.7,19.8 0 top

### Tracks (layer width: path | path; a pad name or v marks a point on that pad's centre or on a via)
5V
  Top 2: J5.1 133.93,63.43 136,65.5 | 136,65.5 136,87.2 133.37,89.83 J4.1 129.4,89.83 125.6,93.63 J3.6 | 136,65.5 136,39.4 133.83,37.23 J6.1
  Bottom 2: J6.1 129.83,37.23 128.7,36.1 128.7,12.6 121.4,5.3 J7.1
12V
  Top 0.406: 14.47,70.2 C1.2 | 14.47,68.2 C2.2
  Top 0.5: 5.29,70.2 5.2,70.3 | 18.3,70.13 18.2,70.13 | 14.6,70.13 C1.2 | 22.37,70.96 23.2,70.13 | 31.2,70.13 31.6,70.13 | C6.2 C5.2 | 35.57,70.66 36.1,70.13
  Top 1: IC1.8 4.09,71.4 5.2,70.3 4.09,69.19 IC1.1 | 10.2,70.2 14.47,70.2 14.47,68.2 | 10.2,70.2 5.29,70.2 | C3.2 23.2,70.13 18.3,70.13 17.29,69.12 IC2.1 | 14.6,70.13 18.2,70.13 17.29,71.04 IC2.8 | IC1.6 9.17,71.23 10.2,70.2 | IC2.6 22.37,70.96 | C4.2 C3.2 | C3.2 31.2,70.13 30.49,70.84 IC3.8 | 44.6,70.13 C5.2 36.1,70.13 31.6,70.13 30.49,69.02 IC3.1 | 44.6,70.13 49.7,70.13 | 49.7,70.13 C8.2 | C7.2 C8.2 | IC4.6 48.77,71.06 49.7,70.13 | IC4.8 43.69,71.04 44.6,70.13 | IC3.6 35.57,70.66 | IC4.1 43.69,69.22 44.6,70.13 | C8.2 57.7,70.13 | 57.7,70.13 58,70.13 | 58,70.13 63.3,70.13 | 63.3,70.13 C11.2 | C11.2 C12.2 | IC5.6 61.97,71.46 63.3,70.13 | IC5.8 56.89,70.94 57.7,70.13 | IC5.1 56.89,69.02 58,70.13 | C11.2 70.9,70.13 | 70.9,70.13 71.5,70.13 | 71.5,70.13 76.1,70.13 | 76.1,70.13 C13.2 | IC6.8 70.09,70.94 70.9,70.13 | IC6.6 75.17,71.06 76.1,70.13 | IC6.1 70.09,68.72 71.5,70.13 | C13.2 C14.2 | C13.2 84.3,70.13 | 84.3,70.13 89.5,70.13 | 89.5,70.13 C9.2 | C9.2 97.7,70.13 | 97.7,70.13 102.7,70.13 | 102.7,70.13 C15.2 | C16.2 C15.2 | C10.2 C9.2 | IC7.8 83.29,71.14 84.3,70.13 | IC7.6 88.37,71.23 88.9,70.7 88.93,70.7 89.5,70.13 | IC7.1 83.29,69.12 84.3,70.13 | IC8.1 96.49,68.92 97.7,70.13 | IC8.8 96.49,71.34 97.7,70.13 | IC8.6 101.57,71.26 102.7,70.13 | C15.2 107.73,70.13 108.7,71.1 108.7,78.7 120.95,90.95 121.28,91.28 121.64,91.64 J3.5
/PERIPHERAL_POWER_ENABLE
  Top 0.5: J8.7 2.35,39.45 1.5,38.6 1.5,20 3.4,18.1 8.2,18.1 13.1,13.2 R13.1 14.41,4.19 17.5,1.1 48,1.1 49.69,2.79 R33.1
GND  (via drill 0.45, 0.5)
  Top 0.2: IC13.4 61.6,24.3 57.6,24.3 | 57.6,24.3 53,24.3 53,18.5 57.6,18.5 57.6,24.3
  Top 0.4: IC13.4
  Top 1.5: J3.1 105.8,93.6 | J3.2 109.76,93.64 | J3.3 113.72,93.68 | J3.4 117.68,93.72
  Bottom 1.5: J3.1 105.8,93.4 | J3.2 109.76,93.24 | J3.3 113.72,93.58 | J3.4 117.68,93.62
  other vias: 7.5,79.8 14.2,79.8 21,79.8 34.3,79.9 48,79.8 62,79.9 41.3,79.9 55,79.9 68.8,80 75.5,80.1 82.1,80.2 89.3,80.1 95.8,80.1 102.8,80.1 111.4,49 97.3,28.7 89.5,26 89.5,28.6 89.5,31.1 89.4,34.2 49.5,13.1 48.3,15.1 48.1,17.8 47.9,20.7 55.2,28.2 68.9,35.8 68.9,38.7 69,41.2 69,43.7 88.7,41.2 88.7,38.7 88.6,43.6 88.5,46 88.5,50.8 60.4,29 58.5,26.8
  pour Top: 0.2,101.8 138.1,101.8 138.1,-0.2 0.2,-0.2
  pour Bottom: 0.2,101.8 138,101.7 138,0.2 0.2,0.2
LAMPCTL1
  Top 0.4: IC9.1 115.16,83.46 109.8,78.1 109.8,63.9 105.8,59.9 73.6,59.9 71.2,57.5 58.3,57.5 50.5,49.7 50.5,41.8 47.4,38.7 47.4,34.1 45.58,32.28 PICO1.GP9
LAMPCTL2
  Top 0.4: PICO1.GP8 45.54,29.74 45.54,29.84 48.1,32.4 48.1,38.2 51.2,41.3 51.2,49.1 58.9,56.8 71.5,56.8 73.7,59 106,59 110.5,63.5 110.5,76.4 115.02,80.92 IC9.2
LAMPCTL3
  Top 0.4: PICO1.GP7 45.7,27.2 46.8,28.3 46.8,30 48.9,32.1 48.9,37.9 52,41 52,48.8 59.2,56 71.8,56 73.9,58.1 106.3,58.1 111.3,63.1 111.3,74.78 114.9,78.38 IC9.3
LAMPCTL4  (via drill 0.45)
  Top 0.4: PICO1.GP6 46.36,24.66 47.5,25.8 47.5,29.5 49.7,31.7 49.7,37.6 52.8,40.7 52.8,48.2 59.6,55 72.1,55 v74.4,57.3 106.8,57.3 112.2,62.7 112.2,73.1 114.94,75.84 IC9.4
LAMPCTL5  (via drill 0.45)
  Top 0.4: v109.8,59.1 113,62.4 113,70.8 115.5,73.3 IC9.5 | v59.6,53.9 53.8,48.1 53.8,40.4 50.5,37.1 50.5,31.4 48.3,29.2 48.3,22.5 45.38,19.58 PICO1.GP5
  Bottom 0.4: v109.8,59.1 98.9,59.1 94.3,63.7 69.4,63.7 v59.6,53.9
LAMPCTL6  (via drill 0.45)
  Top 0.4: PICO1.GP4 45.84,17.04 49.1,20.3 49.1,28.9 51.2,31 51.2,36.6 54.7,40.1 54.7,47.9 v59.6,52.8 | v109.8,57.9 113.9,61.9 113.9,68.7 115.96,70.76 IC9.6
  Bottom 0.4: v109.8,57.9 99.1,57.9 94,63 69.8,63 v59.6,52.8
LAMPCTL7  (via drill 0.45)
  Top 0.4: IC9.7 116.22,68.22 114.6,66.6 114.6,61.4 v109.8,56.6 | v59.6,51.6 55.6,47.6 55.6,39.7 52,36.1 52,30.7 49.9,28.6 49.9,18.2 46.2,14.5 PICO1.GP3
  Bottom 0.4: v109.8,56.6 99.3,56.6 93.6,62.3 70.3,62.3 v59.6,51.6
LAMPCTL8  (via drill 0.45)
  Top 0.4: v109.8,55.4 115.3,60.9 115.3,64.8 116.18,65.68 IC9.8 | v59.6,50.4 56.4,47.2 56.4,39.1 52.8,35.5 52.8,30.4 50.6,28.2 50.6,16 46.56,11.96 PICO1.GP2
  Bottom 0.4: v109.8,55.4 99.3,55.4 93.1,61.6 70.8,61.6 v59.6,50.4
LAMPCTL9
  Top 0.4: PICO2.GP16 71.13,52.63 74.6,56.1 88.2,56.1 91.6,52.7 108.3,52.7 115.86,60.26 IC10.1
LAMPCTL10
  Bottom 0.4: IC10.2 115.92,57.72 112.7,54.5 99.2,54.5 92.8,60.9 79.6,60.9 74.9,56.2 74.9,51.7 73.29,50.09 PICO2.GP17
LAMPCTL11
  Bottom 0.4: PICO2.GP18 70.09,45.01 70.1,45 70.2,45 75.7,50.5 75.7,55.8 80,60.1 92.4,60.1 98.9,53.6 113.2,53.6 114.78,55.18 IC10.3
LAMPCTL12
  Bottom 0.4: PICO2.GP19 70.07,42.47 76.6,49 76.6,55.6 80.3,59.3 91.9,59.3 98.56,52.64 IC10.4
LAMPCTL13
  Bottom 0.4: PICO2.GP20 70.03,39.93 77.6,47.5 77.6,55.4 80.7,58.5 91.2,58.5 98.4,51.3 113.8,51.3 115,50.1 IC10.5
LAMPCTL14
  Bottom 0.4: PICO2.GP21 69.99,37.39 78.6,46 78.6,55.3 81,57.7 90.8,57.7 101.9,46.6 114.3,46.6 115.26,47.56 IC10.6
LAMPCTL15
  Bottom 0.4: PICO2.GP22 68.69,32.31 68.7,32.3 70,33.6 70,35.3 79.5,44.8 79.5,55 81.4,56.9 90.4,56.9 102.28,45.02 IC10.7
LAMPCTL16  (via drill 0.45)
  Top 0.4: PICO2.GP1 83.19,6.91 78.8,11.3 78.8,41.8 v79.9,42.9
  Bottom 0.4: IC10.8 103.72,42.48 90.1,56.1 81.8,56.1 80.3,54.6 80.3,43.3 v79.9,42.9
LAMPCTL17  (via drill 0.45)
  Top 0.4: PICO2.GP0 81.73,4.37 77.3,8.8 v77.3,38.7
  Bottom 0.4: v77.3,38.7 81.2,42.6 81.2,54.1 82.4,55.3 89.7,55.3 105.2,39.8 110.4,39.8 113.24,36.96 IC11.1
LAMPCTL18  (via drill 0.45)
  Top 0.4: v75,25 69.61,19.61 PICO2.GP28_A2
  Bottom 0.4: v75,25 80.3,30.3 80.3,40.3 82.2,42.2 82.2,53.8 82.9,54.5 89.2,54.5 104.9,38.8 109.9,38.8 114.28,34.42 IC11.2
LAMPCTL19
  Bottom 0.4: IC11.3 114.92,31.88 109,37.8 102.9,37.8 88.07,52.63 PICO2.GP15
LAMPCTL20
  Bottom 0.4: IC11.4 116.06,29.34 108.6,36.8 100.5,36.8 87.21,50.09 PICO2.GP14
LAMPCTL21
  Bottom 0.4: IC11.5 117.1,26.8 108,35.9 101.4,35.9 97.6,35.9 88.49,45.01 PICO2.GP13
LAMPCTL22
  Bottom 0.4: IC11.6 116.04,24.26 115,25.3 115,27.6 107.8,34.8 100.3,34.8 96.6,34.8 88.93,42.47 PICO2.GP12
LAMPCTL23
  Bottom 0.4: IC11.7 115.78,21.72 114.2,23.3 114.2,26.9 107.4,33.7 95.6,33.7 89.37,39.93 PICO2.GP11
LAMPCTL24
  Bottom 0.4: IC11.8 115.62,19.18 113.5,21.3 113.5,25.8 106.7,32.6 93.6,32.6 88.81,37.39 PICO2.GP10
LAMPCTL25
  Top 0.4: PICO2.GP9 90.09,32.31 96.3,26.1 107.7,26.1 111.46,22.34 IC12.1
LAMPCTL26
  Top 0.4: IC12.2 108.92,22.48 106.1,25.3 95.5,25.3 91.03,29.77 PICO2.GP8
LAMPCTL27
  Top 0.4: IC12.3 106.38,22.52 104.4,24.5 94.8,24.5 92.07,27.23 PICO2.GP7
LAMPCTL28
  Top 0.4: IC12.4 103.84,22.46 102.5,23.8 93.7,23.8 92.81,24.69 PICO2.GP6
LAMPCTL29
  Top 0.4: PICO2.GP2 87.29,11.99 88.7,13.4 88.7,15.5 90.4,17.2 97.9,17.2 101.3,20.6 IC12.5
LAMPCTL30
  Top 0.4: PICO2.GP3 86.53,14.53 90,18 96.6,18 98.76,20.16 IC12.6
LAMPCTL31
  Top 0.4: PICO2.GP4 87.67,17.07 89.3,18.7 94.1,18.7 96.22,20.82 IC12.7 96.22,21.32
LAMPCTL32
  Top 0.4: PICO2.GP5 89.49,19.61 89.7,19.4 92.8,19.4 93.68,20.28 IC12.8
N$1
  Top 1: R1.1 4.6,75.2 IC1.7
N$2
  Top 1: R2.1 13.1,77.1 11.7,75.7 IC1.5
N$3
  Top 1: R1.2 7.4,75.2 4.44,78.16 Q1.1
N$4
  Top 1: R2.2 11.14,80.08 Q2.1
N$5
  Top 1: R3.1 17.7,75.1 IC2.7
N$6
  Top 1: IC2.5 24.91,75.27 R4.1
N$7
  Top 1: R3.2 20.2,75.1 17.74,77.56 Q3.1
N$8
  Top 1: R4.2 24.54,79.98 Q4.1
N$9
  Top 1: R5.1 31.1,75.1 IC3.7
N$10
  Top 1: IC3.5 38.11,75.37 R6.1
N$11
  Top 1: R5.2 33.8,75.1 31.34,77.56 Q5.1
N$12
  Top 1: Q6.1 38.14,80.48 R6.2
N$13
  Top 1: R7.1 44.3,75.2 IC4.7
N$14
  Top 1: IC4.5 51.31,75.47 R8.1
N$15
  Top 1: Q7.1 45.14,77.26 47.1,75.2 R7.2
N$16
  Top 1: R8.2 48.18,77.1 Q8.1
N$17
  Top 1: PICO2.VSYS 63.41,6.91 62.2,5.7 D1.1
N$18
  Bottom 1: PICO1.VSYS 24.48,6.88 24.4,6.8 20.8,6.8 D2.1
N$19
  Top 1: R14.1 57.4,75.2 IC5.7
N$20
  Top 1: IC5.5 64.51,75.37 R15.1
N$21
  Top 1: R9.1 83.8,75.2 IC7.7
N$22
  Top 1: IC7.5 90.91,74.77 R10.1
N$23
  Top 1: Q13.1 86.04,76.46 87.3,75.2 R9.2
N$24
  Top 1: R10.2 89.08,77.1 Q14.1
N$25
  Top 1: Q9.1 58.74,76.66 60.2,75.2 R14.2
N$26
  Top 1: R15.2 62.18,77.1 Q10.1
N$27
  Top 1: R16.1 70.9,75.2 IC6.7
N$28
  Top 1: IC6.5 77.71,75.37 R17.1
N$29
  Top 1: R16.2 73.5,75.2 72.44,76.26 Q11.1
N$30
  Top 1: R17.2 75.38,77.1 Q12.1
N$31
  Top 1: R11.1 97.1,75.1 IC8.7
N$32
  Top 1: IC8.5 104.11,74.67 R12.1
N$33
  Top 1: Q15.1 99.64,75.66 100.2,75.1 R11.2
N$34
  Top 1: R12.2 102.68,77.1 Q16.1
N$35
  Top 0.4: IC13.3 59.07,21.23 59.6,20.7 59.6,2.9 60.8,1.7 115.2,1.7 117,3.5 117,11.3 114.3,14 114.3,23.6 108.95,28.95 BATT1.+
N$36
  Top 0.3: IC13.1 53.99,19.88
  Top 0.4: 53.99,19.88 Y1.1
N$37
  Top 0.3: Y1.2 56.03,22.64 IC13.2
N$38
  Bottom 0.4: PICO2.3V3 63.4,14.53 58.77,9.9 58,9.9 57.9,9.8 R32.2
N$39
  Top 0.5: Q17.2 55.26,8.74 56.6,7.4 R33.2
N$40
  Top 0.4: 62.4,33.1 56.3,33.1 55.2,32 55.2,30.2 52.2,27.2 52.1,27.2 52.1,14.62 Q17.3 52.72,12.83 R32.1 | 62.4,33.1 63.7,31.8 63.7,30.6 64.53,29.77 PICO2.RUN | S2.4 S2.3 62.96,33.66 62.4,33.1
N$41
  Bottom 0.5: R18.2 18.8,15.6 19.9,14.5 PICO1.3V3
N$42
  Bottom 0.5: R13.2 7.8,13.2 11.06,16.46 Q18.2
N$43
  Top 1: IC12.18 111.46,8.84 111.79,8.51 J7.2
N$44
  Top 1: IC12.17 108.92,8.88 109.25,8.55 J7.3
N$45
  Top 1: IC12.16 106.38,8.92 106.71,8.59 J7.4
N$46
  Top 1: IC12.15 103.84,8.86 104.17,8.53 J7.5
N$47
  Top 1: IC12.14 101.3,8.8 101.63,8.47 J7.6
N$48
  Top 1: IC12.13 98.76,9.14 99.09,8.81 J7.7
N$49
  Top 1: IC12.12 96.22,9.32 96.2,9.3 96.55,8.95 J7.8
N$50
  Top 1: J7.10 91.47,7.47 93.68,9.68 IC12.11
N$51  (via drill 0.55)
  Top 0.5: S1.4 S1.3 14.6,40.71 v14.6,36.4 14.6,26.9 8.52,20.82 Q18.3 | PICO1.RUN 21.26,29.74 v19.4,31.6
  Bottom 0.5: Q18.3 8.52,17.33 R18.1 | v19.4,31.6 v14.6,36.4
N$52
  Top 0.2: 58.2,24.7 52.6,24.7 52.6,18.1 58,18.1 58,23.9
N$53
  Bottom 0.2: 57.9,18.1 52.5,18.1 52.6,25.2 62.6,25.2 62.6,22.1 60.6,22.1 60.6,24.2 58,24.2 58,18.6
N$59
  Top 1: IC11.18 127.14,36.96 129.41,34.69 J6.2
N$60
  Top 1: IC11.17 126.78,34.42 129.05,32.15 J6.3
N$61
  Top 1: IC11.16 126.82,31.88 129.09,29.61 J6.4
N$62
  Top 1: IC11.15 126.66,29.34 128.93,27.07 J6.5
N$63
  Top 1: IC11.14 126.6,26.8 128.87,24.53 J6.6
N$64
  Top 1: IC11.13 126.34,24.26 128.05,22.55 128.3,22.3 128.61,21.99 J6.7
N$65
  Top 1: IC11.12 126.48,21.72 131.29,16.91 J6.9
N$66
  Top 1: IC11.11 126.22,19.18 131.03,14.37 J6.10
N$67
  Top 1: J4.3 129.25,84.75 127.96,83.46 IC9.18
N$68
  Top 1: IC9.17 127.72,80.92 129.01,82.21 J4.4
N$69
  Top 1: IC9.16 127.88,78.38 129.17,79.67 J4.5
N$70
  Top 1: IC9.15 128.14,75.84 129.43,77.13 J4.6
N$71
  Top 1: IC9.14 128.1,73.3 129.39,74.59 J4.7
N$72
  Top 1: IC9.13 127.96,70.76 128.25,71.05 128.6,71.4 129.25,72.05 J4.8
N$73
  Top 1: IC9.12 128.22,68.22 129.51,69.51 J4.9
N$74
  Top 1: IC9.11 127.98,65.68 129.27,66.97 J4.10
N$75
  Top 1: IC10.18 128.16,60.26 128.89,60.99 J5.2
N$76
  Top 1: IC10.17 127.92,57.72 128.1,57.9 128.4,58.2 128.65,58.45 J5.3
N$77
  Top 1: IC10.16 128.58,55.18 129.31,55.91 J5.4
N$78
  Top 1: IC10.15 128.34,52.64 129.07,53.37 J5.5
N$79
  Top 1: IC10.14 128.3,50.1 129.03,50.83 J5.6
N$80
  Top 1: IC10.13 128.24,47.56 128.55,47.25 128.9,46.9 130.05,45.75 J5.8
N$81
  Top 1: IC10.12 127.48,45.02 129.29,43.21 J5.9
N$82
  Top 1: IC10.11 127.02,42.48 128.83,40.67 J5.10
OUT13
  Top 2.5: Q1.2 6.8,83.4 7.7,84.3 7.7,89.9 13.5,95.7 J1.1
OUT14
  Top 2.5: Q2.2 13.2,83.5 14.4,84.7 14.4,88.3 18.42,92.32 J1.2
OUT15
  Top 2.5: Q3.2 20.1,83.4 21.1,84.4 21.1,89.4 23,91.3 23.35,91.65 26.35,94.65 J1.4
OUT16
  Top 2.5: Q4.2 26.8,83.4 28,84.6 28,90.8 30.31,93.11 J1.5
OUT17
  Top 2.5: Q5.2 33.2,83.4 34.7,84.9 34.7,91.3 34.27,91.73 J1.6
OUT18
  Top 2.5: Q6.2 40.3,83.4 41.6,84.7 41.6,89.2 38.23,92.57 J1.7
OUT19
  Top 2.5: Q7.2 47.4,83.4 48.4,84.4 48.4,87.9 45.6,90.7 45.25,91.05 42.19,94.11 J1.8
OUT20
  Top 2.5: Q8.2 54.2,83.4 55.2,84.4 55.2,88.5 51.5,92.2 51.15,92.55 48,95.7 J1.9
OUT21
  Top 2.5: Q9.2 61.2,83.4 62.2,84.4 62.2,91.6 66.3,95.7 J2.1
OUT22
  Top 2.5: Q10.2 68.2,83.4 69.1,84.3 69.1,90.3 72.72,93.92 J2.2
OUT23
  Top 2.5: Q11.2 75,83.4 75.6,84 75.6,84.1 75.9,84.4 75.9,88.7 76.68,89.48 J2.3
OUT24
  Top 2.5: Q12.2 81.3,83.4 82.6,84.8 82.6,92 84.61,94.01 J2.5
OUT25
  Top 2.5: Q13.2 88,83.4 89.4,84.8 89.4,88.1 88.57,88.93 J2.6
OUT26
  Top 2.5: Q14.2 95,83.4 96.2,84.6 96.2,87.7 92.53,91.37 J2.7
OUT27
  Top 2.5: Q15.2 102.1,83.4 103,84.3 103,87.1 101.3,88.8 99.4,88.8 96.49,91.71 J2.8
OUT28
  Top 2.5: Q16.2 108.5,83.4 109.9,84.8 109.9,87.3 108.3,88.9 105.7,88.9 100.46,94.14 J2.9
OUTCTL13
  Top 0.4: IC1.2 6.63,63.37 16,54 16,24.8 21.1,19.7 23.7,19.7 23.82,19.58 PICO1.GP28_A2
OUTCTL14
  Bottom 0.4: IC1.4 11.71,61.59 16.4,56.9 26.6,56.9 37.4,46.1 37.4,6.5 39.56,4.34 PICO1.GP0
OUTCTL15
  Bottom 0.4: IC2.2 19.83,60.07 21.9,58 27,58 37.75,47.25 38.4,46.6 38.5,46.5 38.5,7.9 39.52,6.88 PICO1.GP1
OUTCTL16
  Top 0.4: PICO1.GP22 23.02,32.28 17.4,37.9 17.4,54.9 24.91,62.41 24.91,64.69
  Top 0.5: IC2.4 24.91,64.69
OUTCTL17
  Top 0.4: IC3.2 33.03,63.53 30.9,61.4 25.1,61.4 18.2,54.5 18.2,42.2 22.94,37.46 22.94,37.36 PICO1.GP21
OUTCTL18
  Top 0.4: IC3.4 38.11,63.41 35.4,60.7 25.6,60.7 19,54.1 19,42.8 21.9,39.9 PICO1.GP20
OUTCTL19
  Top 0.4: IC4.2 46.23,63.13 43,59.9 26,59.9 19.8,53.7 19.8,43.7 21.06,42.44 PICO1.GP19
OUTCTL20
  Top 0.4: IC4.4 51.31,63.71 46.8,59.2 26.5,59.2 20.6,53.3 20.6,46.4 22.02,44.98 PICO1.GP18
OUTCTL21
  Top 0.4: IC5.2 59.43,64.73 57.9,63.3 52,63.3 47.1,58.4 26.9,58.4 21.4,52.9 21.4,51 22.34,50.06 PICO1.GP17
OUTCTL22
  Top 0.4: IC5.4 63.08,63.8 60.4,63.8 59.1,62.6 52.4,62.6 47.4,57.6 28.9,57.6 25.56,54.26 PICO1.GP16
OUTCTL23
  Top 0.4: IC6.2 69.3,61.9 55.5,61.9 46.2,52.6 PICO1.GP15
OUTCTL24
  Top 0.4: PICO1.GP14 46.36,50.06 47,50.6 47,52.1 56.1,61.2 69.6,61.2 72,63.6 76.08,63.6 IC6.4
OUTCTL25
  Top 0.4: IC7.2 83.5,62.9 72.3,62.9 69.9,60.5 56.6,60.5 47.7,51.6 47.7,46.4 46.28,44.98 PICO1.GP13
OUTCTL26
  Top 0.4: PICO1.GP12 46.44,42.44 48.4,44.4 48.4,51 57.2,59.8 70.2,59.8 72.6,62.2 87.88,62.2 IC7.4
OUTCTL27
  Top 0.4: IC8.2 95.3,61.5 73,61.5 70.6,59.1 57.6,59.1 49.1,50.6 49.1,42.6 46.4,39.9 PICO1.GP11
OUTCTL28
  Top 0.4: IC8.4 99.68,60.8 73.4,60.8 70.9,58.3 57.9,58.3 49.8,50.2 49.8,42.1 46.7,39 46.7,38 46.06,37.36 PICO1.GP10
SCL
  Top 0.4: PICO2.GP27_A1 66.47,24.7 62.9,24.7 59.07,28.53 IC13.6
  Bottom 0.4: J8.3 4.8,29.2 13.7,29.2 18.2,24.7 25.52,24.7 PICO1.GP27_A1 28.04,24.66 29.9,22.8 29.9,5.3 34.2,1 50.7,1 54,4.3 54,9.2 56.5,11.7 58.9,11.7 62.9,15.7 63.1,15.9 63.4,16.2 63.4,21.4 63.4,21.5 63.4,23.5 64.6,24.7 PICO2.GP27_A1
SDA
  Top 0.4: PICO2.GP26_A0 63.4,27.23 61.61,29.02 IC13.5
  Bottom 0.4: J8.5 4.82,34.48 11.02,34.48 18.3,27.2 PICO1.GP26_A0 29.2,27.2 32.4,24 32.4,6.5 36.4,2.5 48.3,2.5 51.2,5.4 51.2,30.8 52.9,32.5 61,32.5 61.61,31.89 IC13.5
VBUS
  Top 0.4: D1.2 48.1,10.1 51.4,13.5 51.4,27.9 53.99,30.49 IC13.8
  Top 1: D2.2 18.2,17.4 20.9,14.7 20.9,3.5 22.2,2.2 46.7,2.2 48.1,3.6 D1.2
  Bottom 1: J8.1 13.89,24.21 18.2,19.9 D2.2

### Text on the board
tPlace: CR2032
tNames: HIGH POWER OUTPUTS 13-20 | HIGH POWER OUTPUTS 21-28 | 2ND PSU | 13 | 14 | X | 15 | 16 | 17 | 18 | 19 | 20 | 21 | 22 | 23 | X | 24 | 25 | 26 | 27 | 28 | GND | GND | GND | GND | 12V | 5V | 5V | X | 1 | 2 | 3 | LAMPS 1-8 | 4 | 5 | 6 | 7 | 8 | 5V | 9 | PINSCAPE / PICO | 10 | PWMWORKER 1 | PWMWORKER 2 | 11 | DIY POWER BOARD | REV 20250326 | 12 | LAMPS 9-16 | 13 | RESET 1 | X | 14 | RESET 2 | 15 | 16 | 5V | 17 | TO MAIN BOARD | 18 | 19 | 20 | LAMPS 17-24 | 21 | 22 | X | 23 | 24 | 32 | X | 31 | 30 | 29 | 28 | 27 | 26 | 25 | 5V | LAMPS 25-32